# Altium schematic sheet Sch_MCU.SchDoc
size A
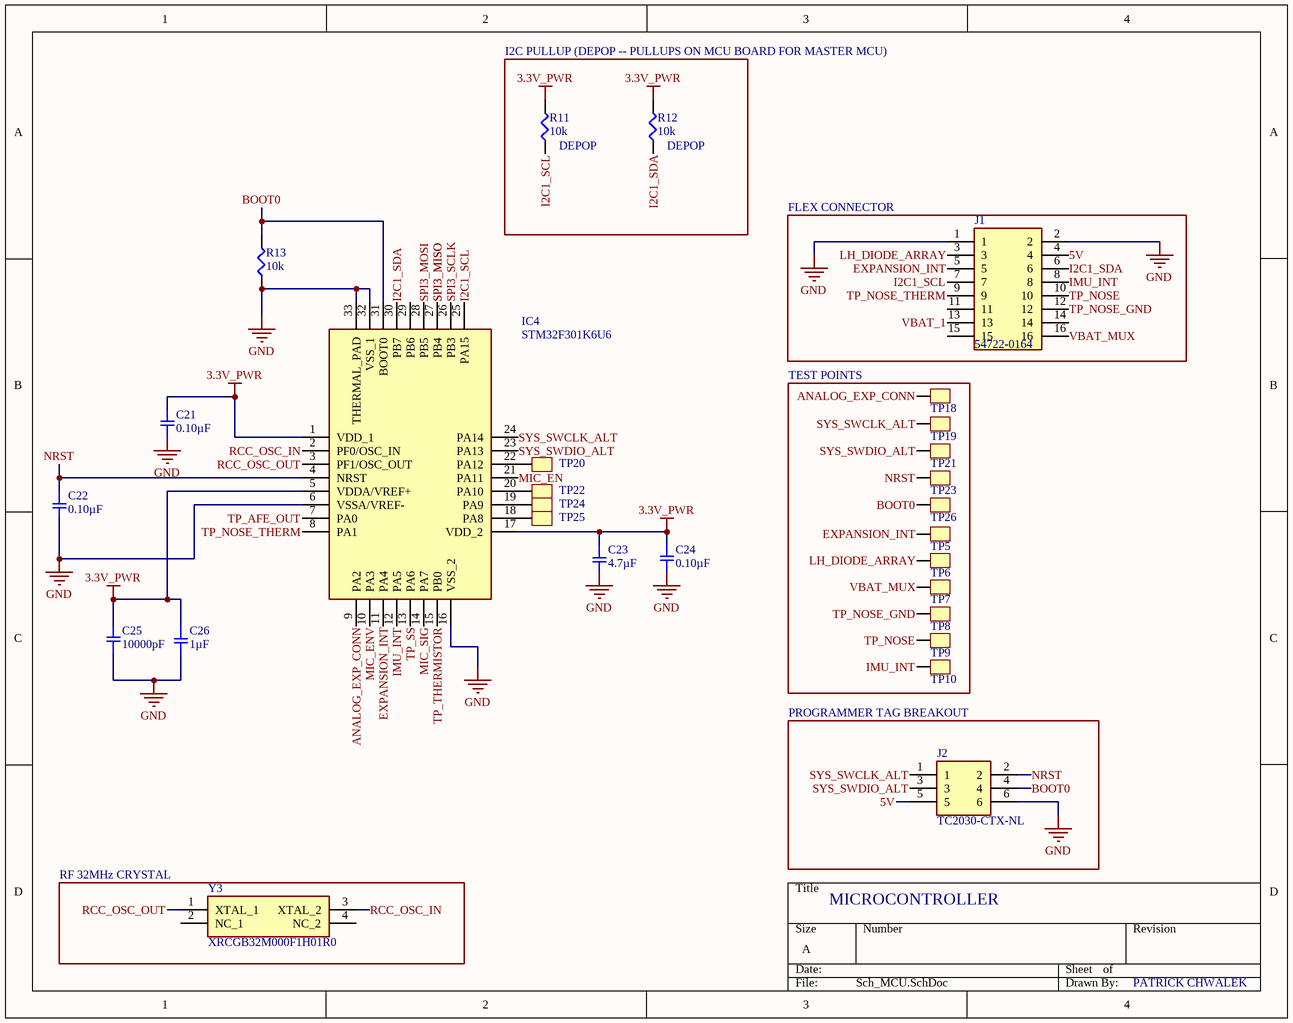
[diagram p0: Sch_MCU.SchDoc]

## Parts
C21  0.10µF  [SMD-0402C]
C22  0.10µF  [SMD-0402C]
C23  4.7µF  [SMD-0402C]
C24  0.10µF  [SMD-0402C]
C25  10000pF  [SMD-0402C]
C26  1µF  [SMD-0402C]
IC4  STM32F301K6U6  [QFN50P500X500X60-33N-D]
J1  54722-0164  [54722-0164]
J2  TC2030-CTX-NL  [TC2030MCPNL10]
R11  10k  [SMD-0402-RES]
R12  10k  [SMD-0402-RES]
R13  10k  [SMD-0402-RES]
TP5  TestPoint  [TestPoint_0.4mm]  (value not drawn)
TP6  TestPoint  [TestPoint_0.4mm]  (value not drawn)
TP7  TestPoint  [TestPoint_0.4mm]  (value not drawn)
TP8  TestPoint  [TestPoint_0.4mm]  (value not drawn)
TP9  TestPoint  [TestPoint_0.4mm]  (value not drawn)
TP10  TestPoint  [TestPoint_0.4mm]  (value not drawn)
TP18  TestPoint  [TestPoint_0.4mm]  (value not drawn)
TP19  TestPoint  [TestPoint_0.4mm]  (value not drawn)
TP20  TestPoint  [TESTPOINT_1MM_OVAL]  (value not drawn)
TP21  TestPoint  [TestPoint_0.4mm]  (value not drawn)
TP22  TestPoint  [TESTPOINT_1MM_OVAL]  (value not drawn)
TP23  TestPoint  [TestPoint_0.4mm]  (value not drawn)
TP24  TestPoint  [TESTPOINT_1MM_OVAL]  (value not drawn)
TP25  TestPoint  [TESTPOINT_1MM_OVAL]  (value not drawn)
TP26  TestPoint  [TestPoint_0.4mm]  (value not drawn)
Y3  XRCGB32M000F1H01R0  [XRCGB32M000F1H01R0]

## Blocks framed on the sheet
FLEX CONNECTOR: J1
TEST POINTS: TP5-TP10 TP18 TP19 TP21 TP23 TP26
PROGRAMMER TAG BREAKOUT: J2
RF 32MHz CRYSTAL: Y3

## Nets
3.3V_PWR: C21.2 C23.1 C24.2 C25.2 C26.1 IC4.1(VDD_1) IC4.5(VDDA/VREF+) IC4.17(VDD_2) R11.2 R12.2
GND: C21.1 C22.2 C23.2 C24.1 C25.1 C26.2 IC4.6(VSSA/VREF-) IC4.16(VSS_2) IC4.32(VSS_1) IC4.33(THERMAL_PAD) J1.1 J1.2 J2.6 R13.1
5V: J1.4 J2.5
ANALOG_EXP_CONN: IC4.9(PA2) TP18.1
BOOT0: IC4.31(BOOT0) J2.4 R13.2 TP26.1
EXPANSION_INT: IC4.11(PA4) J1.5 TP5.1
I2C1_SCL: IC4.25(PA15) J1.7 R11.1
I2C1_SDA: IC4.30(PB7) J1.6 R12.1
IMU_INT: IC4.12(PA5) J1.8 TP10.1
LH_DIODE_ARRAY: J1.3 TP6.1
MIC_EN: IC4.21(PA11)
MIC_ENV: IC4.10(PA3)
MIC_SIG: IC4.14(PA7)
NRST: C22.1 IC4.4(NRST) J2.2 TP23.1
RCC_OSC_IN: IC4.2(PF0/OSC_IN) Y3.3(XTAL_2)
RCC_OSC_OUT: IC4.3(PF1/OSC_OUT) Y3.1(XTAL_1)
SPI3_MISO: IC4.27(PB4)
SPI3_MOSI: IC4.28(PB5)
SPI3_SCLK: IC4.26(PB3)
SYS_SWCLK_ALT: IC4.24(PA14) J2.1 TP19.1
SYS_SWDIO_ALT: IC4.23(PA13) J2.3 TP21.1
TP_AFE_OUT: IC4.7(PA0)
TP_NOSE: J1.10 TP9.1
TP_NOSE_GND: J1.12 TP8.1
TP_NOSE_THERM: IC4.8(PA1) J1.9
TP_SS: IC4.13(PA6)
TP_THERMISTOR: IC4.15(PB0)
VBAT_1: J1.13
VBAT_MUX: J1.16 TP7.1
NetIC4_18: IC4.18(PA8) TP25.1
NetIC4_19: IC4.19(PA9) TP24.1
NetIC4_20: IC4.20(PA10) TP22.1
NetIC4_22: IC4.22(PA12) TP20.1

Not connected (* = marked no-connect by the designer): IC4 29(PB6); J1 11 14 15; Y3 2(NC_1) 4(NC_2)

## Notes on the sheet
- I2C PULLUP (DEPOP -- PULLUPS ON MCU BOARD FOR MASTER MCU)
- (near R11) DEPOP
- (near R12) DEPOP
- MICROCONTROLLER
- PATRICK CHWALEK

## Library data of the parts
C21 C22 C24 = GCM155R71C104KA55D: CAP CER 0.1UF 16V X7R 0402; Manufacturer: Murata Electronics North America; Factory Stock: 0; Unit Price (USD): 0.1; Minimum Quantity: 1; Tolerance: ±10%; Datasheets: http://www.murata.com/~/media/webrenewal/support/library/catalog/products/capacitor/mlcc/c03e.ashx; Image: //media.digikey.com/Renders/Murata%20Renders/ZRB-SERIES-0402.jpg; Digi-Key Part Number: 490-4759-1-ND; Part Number: GCM155R71C104KA55D; Quantity Available: 734194; @ qty: 0; Packaging: Cut Tape (CT); Series: GCM; Part Status: Active; Value: 0.10µF; Voltage: 16V; Temperature Coefficient: X7R; Operating Temperature: -55°C ~ 125°C; Features: -; Ratings: AEC-Q200; Applications: Automotive; Mounting Type: Surface Mount, MLCC; Package / Case: 0402 (1005 Metric); Size / Dimension: 0.039" L x 0.020" W (1.00mm x 0.50mm); Height - Seated (Max): -; Thickness (Max): 0.022" (0.55mm); Lead Spacing: -; Lead Style: -
C23 = GRM153R60G475ME15D: CAP CER 4.7UF 4V X5R 0402; Manufacturer: Murata Electronics North America; Factory Stock: 0; Unit Price (USD): 0.27; Minimum Quantity: 1; Tolerance: ±20%; Datasheets: http://psearch.en.murata.com/capacitor/product/GRM153R60G475ME15%23.pdf; Image: //media.digikey.com/Renders/Murata%20Renders/ZRB-SERIES-0402.jpg; Digi-Key Part Number: 490-13231-1-ND; Part Number: GRM153R60G475ME15D; Quantity Available: 9100; @ qty: 0; Packaging: Cut Tape (CT); Series: GRM; Part Status: Active; Value: 4.7µF; Voltage: 4V; Temperature Coefficient: X5R; Operating Temperature: -55°C ~ 85°C; Features: -; Ratings: -; Applications: General Purpose; Mounting Type: Surface Mount, MLCC; Package / Case: 0402 (1005 Metric); Size / Dimension: 0.039" L x 0.020" W (1.00mm x 0.50mm); Height - Seated (Max): -; Thickness (Max): 0.013" (0.33mm); Lead Spacing: -; Lead Style: -
C25 = GCM155R71H103KA55D: CAP CER 10000PF 50V X7R 0402; Manufacturer: Murata Electronics North America; Factory Stock: 0; Unit Price (USD): 0.1; Minimum Quantity: 1; Tolerance: ±10%; Datasheets: http://www.murata.com/~/media/webrenewal/support/library/catalog/products/capacitor/mlcc/c03e.ashx; Image: //media.digikey.com/Renders/Murata%20Renders/ZRB-SERIES-0402.jpg; Digi-Key Part Number: 490-4762-1-ND; Part Number: GCM155R71H103KA55D; Quantity Available: 650067; @ qty: 0; Packaging: Cut Tape (CT); Series: GCM; Part Status: Active; Value: 10000pF; Voltage: 50V; Temperature Coefficient: X7R; Operating Temperature: -55°C ~ 125°C; Features: -; Ratings: AEC-Q200; Applications: Automotive; Mounting Type: Surface Mount, MLCC; Package / Case: 0402 (1005 Metric); Size / Dimension: 0.039" L x 0.020" W (1.00mm x 0.50mm); Height - Seated (Max): -; Thickness (Max): 0.022" (0.55mm); Lead Spacing: -; Lead Style: -
C26 = GCM155C71A105KE38D: CAP CER 1UF 10V X7S 0402; Manufacturer: Murata Electronics North America; Factory Stock: 0; Unit Price (USD): 0.12; Minimum Quantity: 1; Tolerance: ±10%; Datasheets: http://www.murata.com/~/media/webrenewal/support/library/catalog/products/capacitor/mlcc/c03e.ashx; Image: //media.digikey.com/Renders/Murata%20Renders/ZRB-SERIES-0402.jpg; Digi-Key Part Number: 490-13409-1-ND; Part Number: GCM155C71A105KE38D; Quantity Available: 7240; @ qty: 0; Packaging: Cut Tape (CT); Series: GCM; Part Status: Active; Value: 1µF; Voltage: 10V; Temperature Coefficient: X7S; Operating Temperature: -55°C ~ 125°C; Features: -; Ratings: AEC-Q200; Applications: Automotive; Mounting Type: Surface Mount, MLCC; Package / Case: 0402 (1005 Metric); Size / Dimension: 0.039" L x 0.020" W (1.00mm x 0.50mm); Height - Seated (Max): -; Thickness (Max): 0.022" (0.55mm); Lead Spacing: -; Lead Style: -
IC4 = STM32F301K6U6: Integrated Circuit; Manufacturer_Name: STMicroelectronics; Datasheet Link: http://www.mouser.com/ds/2/389/stm32f301c6-956213.pdf; Height: 0.6mm; Manufacturer_Part_Number: STM32F301K6U6; Mouser Part Number: 511-STM32F301K6U6; Mouser Price/Stock: https://www.mouser.com/Search/Refine.aspx?Keyword=511-STM32F301K6U6
J1 = 54722-0164: Connector; Manufacturer_Name: Molex; Datasheet Link: http://www.molex.com/webdocs/datasheets/pdf/en-us//0547220164_PCB_RECEPTACLES.pdf; Manufacturer_Part_Number: 54722-0164; Mouser Part Number: 538-54722-0164; Mouser Price/Stock: https://www.mouser.com/Search/Refine.aspx?Keyword=538-54722-0164; RS Part Number: 7206511; RS Price/Stock: https://uk.rs-online.com/web/p/products/7206511
J2 = TC2030-CTX-NL: Connector; Manufacturer_Name: Tag Connect; Datasheet Link: http://www.tag-connect.com/Materials/TC2030-CTX.pdf; Height: 18mm; Manufacturer_Part_Number: TC2030-CTX-NL
R11-R13 = ERJ-2GEJ103X: RES SMD 10K OHM 5% 1/10W 0402; Manufacturer: Panasonic Electronic Components; Factory Stock: 0; Unit Price (USD): 0.00350; @ qty: 1500; Minimum Quantity: 1; Power (Watts): 0.1W, 1/10W; Temperature Coefficient: ±200ppm/°C; Part Number: ERJ-2GEJ103X; Datasheets: http://industrial.panasonic.com/www-cgi/jvcr13pz.cgi?E+PZ+3+AOA0001+ERJ2GEJ103X+7+WW; Image: //media.digikey.com/Photos/Panasonic%20Photos/ERJ-PA2-Series.jpg; Digi-Key Part Number: P10KJCT-ND; Quantity Available: 2560215; Packaging: Cut Tape (CT); Series: ERJ; Part Status: Active; Value: 10k; Tolerance: ±5%; Composition: Thick Film; Features: Automotive AEC-Q200; Operating Temperature: -55°C ~ 155°C; Package / Case: 0402 (1005 Metric); Supplier Device Package: 0402; Size / Dimension: 0.039" L x 0.020" W (1.00mm x 0.50mm); Height - Seated (Max): 0.016" (0.40mm); Number of Terminations: 2; Failure Rate: -
Y3 = XRCGB32M000F1H01R0: Crystal or Oscillator; Manufacturer_Name: Murata Electronics; Datasheet Link: https://www.murata.com/en-eu/products/productdetail?partno=XRCGB32M000F1H01R0; Height: 0.7mm; Manufacturer_Part_Number: XRCGB32M000F1H01R0; Mouser Part Number: 81-XRCGB32M000F1H01R; Mouser Price/Stock: https://www.mouser.com/Search/Refine.aspx?Keyword=81-XRCGB32M000F1H01R